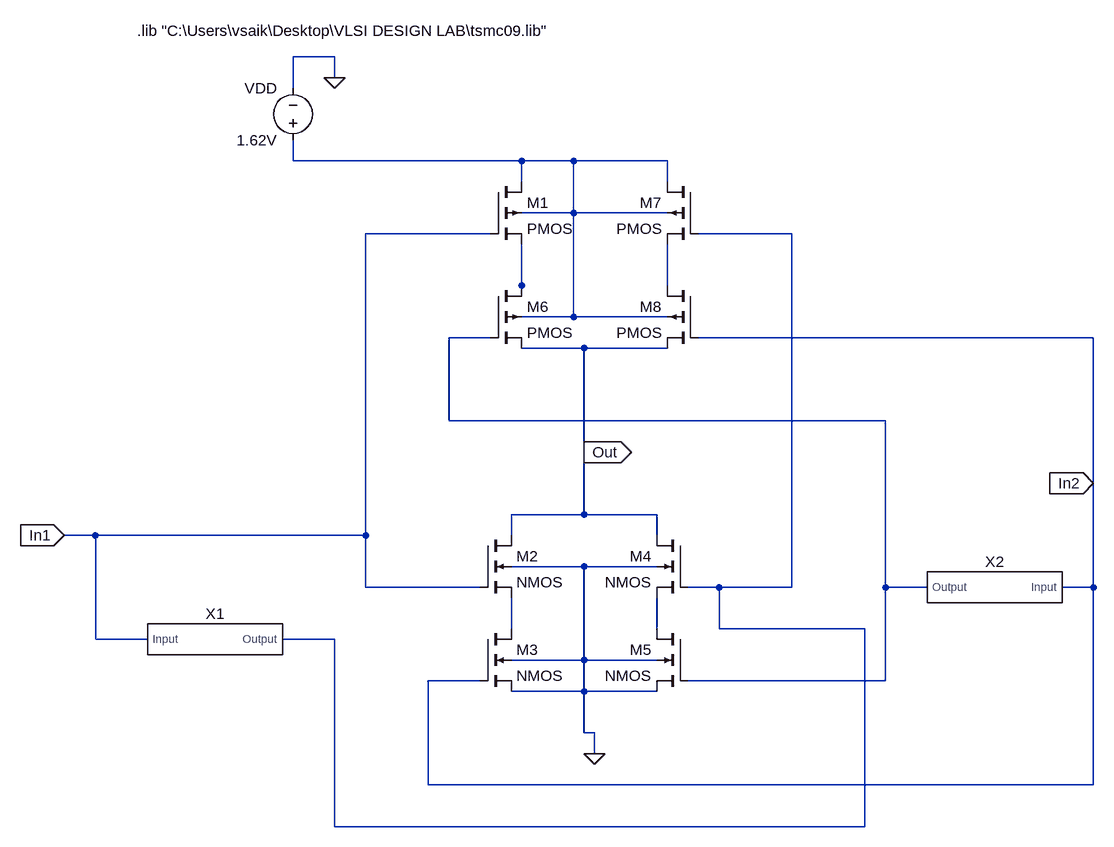
[diagram p0: schematic XOR_model1.asc]
XOR_model1.asc, the LTspice schematic file:
Version 4
SHEET 1 2196 1236
WIRE 480 48 416 48
WIRE 480 80 480 48
WIRE 416 96 416 48
WIRE 416 208 416 176
WIRE 768 208 416 208
WIRE 848 208 768 208
WIRE 992 208 848 208
WIRE 768 240 768 208
WIRE 992 240 992 208
WIRE 848 288 848 208
WIRE 848 288 768 288
WIRE 992 288 848 288
WIRE 720 320 528 320
WIRE 1184 320 1040 320
WIRE 768 400 768 336
WIRE 992 400 992 336
WIRE 768 416 768 400
WIRE 848 448 848 288
WIRE 848 448 768 448
WIRE 992 448 848 448
WIRE 720 480 656 480
WIRE 1648 480 1040 480
WIRE 864 496 768 496
WIRE 992 496 864 496
WIRE 656 608 656 480
WIRE 1328 608 656 608
WIRE 864 656 864 496
WIRE 1648 704 1648 480
WIRE 864 752 864 656
WIRE 864 752 752 752
WIRE 976 752 864 752
WIRE 112 784 64 784
WIRE 528 784 528 320
WIRE 528 784 112 784
WIRE 752 784 752 752
WIRE 976 784 976 752
WIRE 864 832 752 832
WIRE 976 832 864 832
WIRE 528 864 528 784
WIRE 704 864 528 864
WIRE 1072 864 1024 864
WIRE 1184 864 1184 320
WIRE 1184 864 1072 864
WIRE 1328 864 1328 608
WIRE 1392 864 1328 864
WIRE 1648 864 1648 704
WIRE 1648 864 1600 864
WIRE 752 928 752 880
WIRE 976 928 976 880
WIRE 1072 928 1072 864
WIRE 1296 928 1072 928
WIRE 112 944 112 784
WIRE 192 944 112 944
WIRE 480 944 400 944
WIRE 864 976 864 832
WIRE 864 976 752 976
WIRE 976 976 864 976
WIRE 704 1008 624 1008
WIRE 1328 1008 1328 864
WIRE 1328 1008 1024 1008
WIRE 864 1024 864 976
WIRE 864 1024 752 1024
WIRE 976 1024 864 1024
WIRE 864 1088 864 1024
WIRE 880 1088 864 1088
WIRE 880 1120 880 1088
WIRE 624 1168 624 1008
WIRE 1648 1168 1648 864
WIRE 1648 1168 624 1168
WIRE 480 1232 480 944
WIRE 1296 1232 1296 928
WIRE 1296 1232 480 1232
FLAG 480 80 0
FLAG 880 1120 0
FLAG 64 784 In1
IOPIN 64 784 In
FLAG 1648 704 In2
IOPIN 1648 704 In
FLAG 864 656 Out
IOPIN 864 656 Out
SYMBOL pmos4 720 240 R0
SYMATTR InstName M1
SYMATTR Value2 l=90n w=440n
SYMBOL nmos4 704 784 R0
SYMATTR InstName M2
SYMATTR Value2 l=90n w=220n
SYMBOL nmos4 704 928 R0
SYMATTR InstName M3
SYMATTR Value2 l=90n w=220n
SYMBOL nmos4 1024 784 M0
SYMATTR InstName M4
SYMATTR Value2 l=90n w=220n
SYMBOL nmos4 1024 928 M0
SYMATTR InstName M5
SYMATTR Value2 l=90n w=220n
SYMBOL voltage 416 192 R180
WINDOW 0 24 96 Left 2
WINDOW 3 24 16 Left 2
SYMATTR InstName VDD
SYMATTR Value 1.62V
SYMBOL pmos4 720 400 R0
SYMATTR InstName M6
SYMATTR Value2 l=90n w=440n
SYMBOL pmos4 1040 240 M0
SYMATTR InstName M7
SYMATTR Value2 l=90n w=440n
SYMBOL pmos4 1040 400 M0
SYMATTR InstName M8
SYMATTR Value2 l=90n w=440n
SYMBOL NOT_model1 288 944 R0
SYMATTR InstName X1
SYMBOL NOT_model1 1504 864 M0
SYMATTR InstName X2
TEXT 176 8 Left 2 !.lib "C:\\Users\\vsaik\\Desktop\\VLSI DESIGN LAB\\tsmc09.lib"

The netlist it stands for:
* XOR_model1.asc
M1 N001 In1 N003 N001 PMOS l=90n w=440n
M2 Out In1 N006 0 NMOS l=90n w=220n
M3 N006 In2 0 0 NMOS l=90n w=220n
M4 Out N002 N007 0 NMOS l=90n w=220n
M5 N007 N005 0 0 NMOS l=90n w=220n
VDD N001 0 1.62V
M6 N003 N005 Out N001 PMOS l=90n w=440n
M7 N001 N002 N004 N001 PMOS l=90n w=440n
M8 N004 In2 Out N001 PMOS l=90n w=440n
XX1 In1 N002 NOT0  ; pins Input Output
XX2 In2 N005 NOT0  ; pins Input Output
.model NMOS NMOS
.model PMOS PMOS
.lib standard.mos
.lib "C:\Users\vsaik\Desktop\VLSI DESIGN LAB\tsmc09.lib"
.backanno
.end